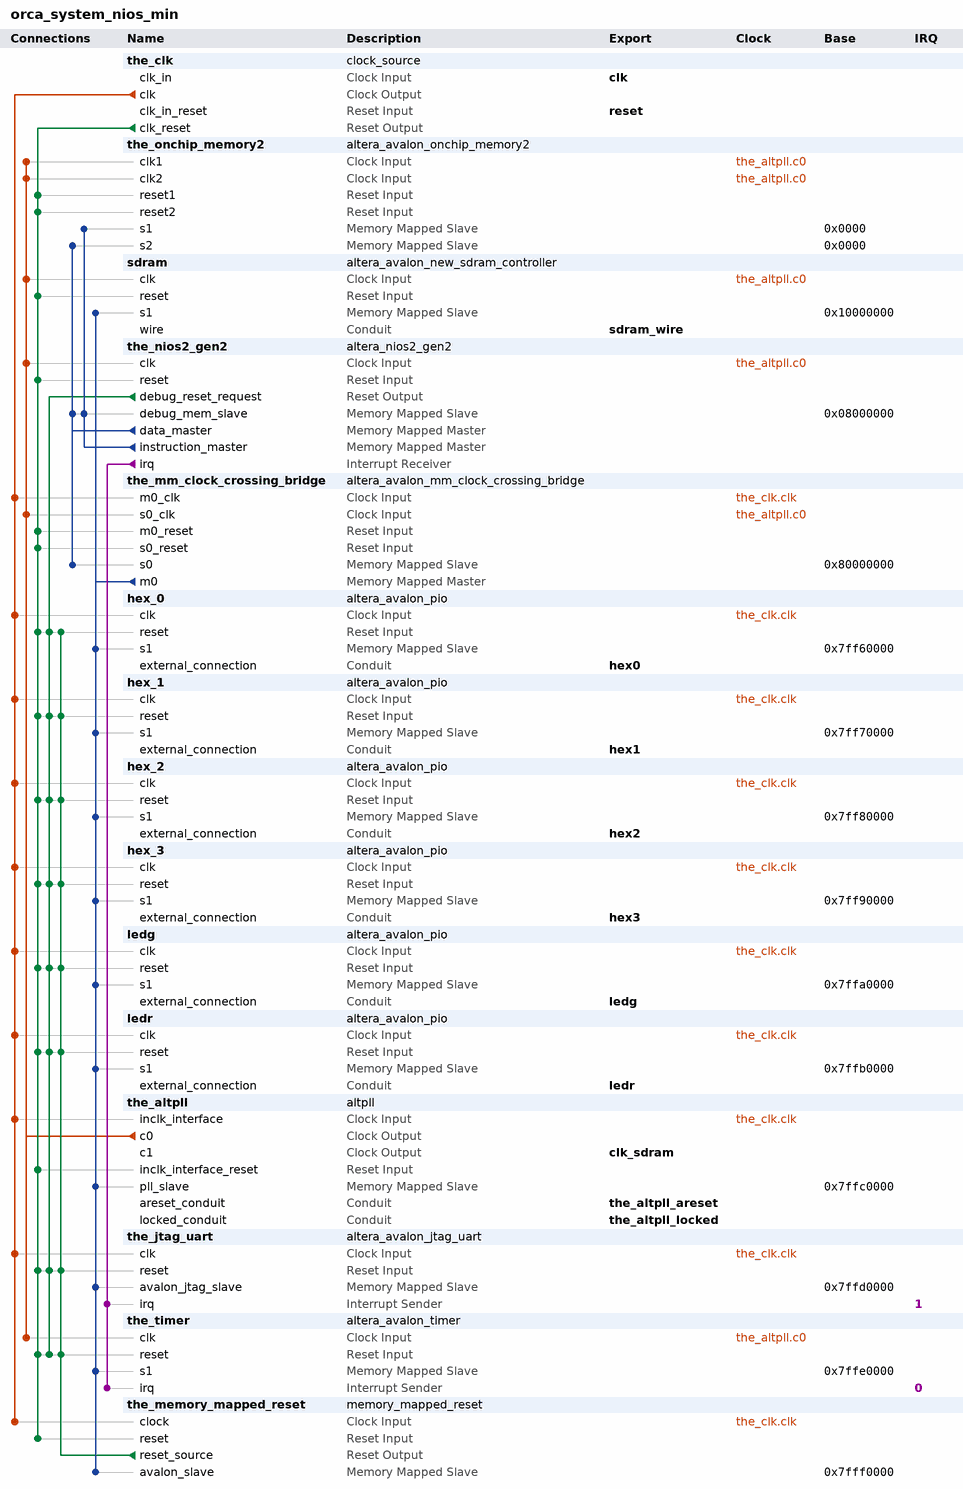
[diagram p0: system contents]
# Platform Designer (Qsys) system orca_system_nios_min, Cyclone IV E EP4CE115F29C7
# Parameters at their usual value, and those the tool derives, are not listed.
package require -exact qsys 17.1
create_system orca_system_nios_min
set_project_property DEVICE_FAMILY {Cyclone IV E}
set_project_property DEVICE EP4CE115F29C7

add_instance the_clk clock_source 17.1
set_instance_parameter_value the_clk clockFrequency 50000000

add_instance the_onchip_memory2 altera_avalon_onchip_memory2 17.1
set_instance_parameter_value the_onchip_memory2 dataWidth 32
set_instance_parameter_value the_onchip_memory2 dualPort true
set_instance_parameter_value the_onchip_memory2 initMemContent true
set_instance_parameter_value the_onchip_memory2 initializationFileName software/test.hex
set_instance_parameter_value the_onchip_memory2 memorySize 65536
set_instance_parameter_value the_onchip_memory2 useNonDefaultInitFile true

add_instance sdram altera_avalon_new_sdram_controller 17.1
set_instance_parameter_value sdram TAC 5.5
set_instance_parameter_value sdram TRCD 20.0
set_instance_parameter_value sdram TRP 20.0
set_instance_parameter_value sdram casLatency 3
set_instance_parameter_value sdram columnWidth 10
set_instance_parameter_value sdram dataWidth 32
set_instance_parameter_value sdram generateSimulationModel true
set_instance_parameter_value sdram model single_Micron_MT48LC4M32B2_7_chip
set_instance_parameter_value sdram numberOfBanks 4
set_instance_parameter_value sdram numberOfChipSelects 1
set_instance_parameter_value sdram powerUpDelay 100.0
set_instance_parameter_value sdram refreshPeriod 15.625
set_instance_parameter_value sdram rowWidth 13

add_instance the_nios2_gen2 altera_nios2_gen2 17.1
set_instance_parameter_value the_nios2_gen2 dcache_size 2048
set_instance_parameter_value the_nios2_gen2 exceptionSlave the_onchip_memory2.s1
set_instance_parameter_value the_nios2_gen2 icache_size 4096
set_instance_parameter_value the_nios2_gen2 impl Tiny
set_instance_parameter_value the_nios2_gen2 resetSlave the_onchip_memory2.s1

add_instance the_mm_clock_crossing_bridge altera_avalon_mm_clock_crossing_bridge 17.1
set_instance_parameter_value the_mm_clock_crossing_bridge ADDRESS_WIDTH 31
set_instance_parameter_value the_mm_clock_crossing_bridge COMMAND_FIFO_DEPTH 4
set_instance_parameter_value the_mm_clock_crossing_bridge DATA_WIDTH 32
set_instance_parameter_value the_mm_clock_crossing_bridge MASTER_SYNC_DEPTH 2
set_instance_parameter_value the_mm_clock_crossing_bridge MAX_BURST_SIZE 1
set_instance_parameter_value the_mm_clock_crossing_bridge RESPONSE_FIFO_DEPTH 4
set_instance_parameter_value the_mm_clock_crossing_bridge SLAVE_SYNC_DEPTH 2
set_instance_parameter_value the_mm_clock_crossing_bridge USE_AUTO_ADDRESS_WIDTH 0

add_instance hex_0 altera_avalon_pio 17.1
set_instance_parameter_value hex_0 direction Output
set_instance_parameter_value hex_0 width 32

add_instance hex_1 altera_avalon_pio 17.1
set_instance_parameter_value hex_1 direction Output
set_instance_parameter_value hex_1 width 32

add_instance hex_2 altera_avalon_pio 17.1
set_instance_parameter_value hex_2 direction Output
set_instance_parameter_value hex_2 width 32

add_instance hex_3 altera_avalon_pio 17.1
set_instance_parameter_value hex_3 direction Output
set_instance_parameter_value hex_3 width 32

add_instance ledg altera_avalon_pio 17.1
set_instance_parameter_value ledg direction Output
set_instance_parameter_value ledg width 32

add_instance ledr altera_avalon_pio 17.1
set_instance_parameter_value ledr direction Output
set_instance_parameter_value ledr width 32

add_instance the_altpll altpll 17.1
set_instance_parameter_value the_altpll CLK0_DIVIDE_BY 1
set_instance_parameter_value the_altpll CLK0_MULTIPLY_BY 2
set_instance_parameter_value the_altpll CLK1_DIVIDE_BY 1
set_instance_parameter_value the_altpll CLK1_DUTY_CYCLE 50
set_instance_parameter_value the_altpll CLK1_MULTIPLY_BY 2
set_instance_parameter_value the_altpll CLK1_PHASE_SHIFT -1500
set_instance_parameter_value the_altpll INCLK0_INPUT_FREQUENCY 20000
set_instance_parameter_value the_altpll PORT_ARESET PORT_USED
set_instance_parameter_value the_altpll PORT_LOCKED PORT_USED
set_instance_parameter_value the_altpll PORT_clk1 PORT_USED
set_instance_parameter_value the_altpll PORT_clk2 PORT_UNUSED
set_instance_parameter_value the_altpll PORT_clk3 PORT_UNUSED

add_instance the_jtag_uart altera_avalon_jtag_uart 17.1
set_instance_parameter_value the_jtag_uart simInteractiveOptions NO_INTERACTIVE_WINDOWS

add_instance the_timer altera_avalon_timer 17.1
set_instance_parameter_value the_timer period 1
set_instance_parameter_value the_timer periodUnits MSEC

add_instance the_memory_mapped_reset memory_mapped_reset 1.0
set_instance_parameter_value the_memory_mapped_reset ADDR_WIDTH 2
set_instance_parameter_value the_memory_mapped_reset REGISTER_SIZE 32

# connections
add_connection the_altpll.c0 sdram.clk clock
add_connection the_altpll.c0 the_mm_clock_crossing_bridge.s0_clk clock
add_connection the_altpll.c0 the_nios2_gen2.clk clock
add_connection the_altpll.c0 the_onchip_memory2.clk1 clock
add_connection the_altpll.c0 the_onchip_memory2.clk2 clock
add_connection the_altpll.c0 the_timer.clk clock
add_connection the_clk.clk hex_0.clk clock
add_connection the_clk.clk hex_1.clk clock
add_connection the_clk.clk hex_2.clk clock
add_connection the_clk.clk hex_3.clk clock
add_connection the_clk.clk ledg.clk clock
add_connection the_clk.clk ledr.clk clock
add_connection the_clk.clk the_altpll.inclk_interface clock
add_connection the_clk.clk the_jtag_uart.clk clock
add_connection the_clk.clk the_memory_mapped_reset.clock clock
add_connection the_clk.clk the_mm_clock_crossing_bridge.m0_clk clock
add_connection the_clk.clk_reset hex_0.reset reset
add_connection the_clk.clk_reset hex_1.reset reset
add_connection the_clk.clk_reset hex_2.reset reset
add_connection the_clk.clk_reset hex_3.reset reset
add_connection the_clk.clk_reset ledg.reset reset
add_connection the_clk.clk_reset ledr.reset reset
add_connection the_clk.clk_reset sdram.reset reset
add_connection the_clk.clk_reset the_altpll.inclk_interface_reset reset
add_connection the_clk.clk_reset the_jtag_uart.reset reset
add_connection the_clk.clk_reset the_memory_mapped_reset.reset reset
add_connection the_clk.clk_reset the_mm_clock_crossing_bridge.m0_reset reset
add_connection the_clk.clk_reset the_mm_clock_crossing_bridge.s0_reset reset
add_connection the_clk.clk_reset the_nios2_gen2.reset reset
add_connection the_clk.clk_reset the_onchip_memory2.reset1 reset
add_connection the_clk.clk_reset the_onchip_memory2.reset2 reset
add_connection the_clk.clk_reset the_timer.reset reset
add_connection the_memory_mapped_reset.reset_source hex_0.reset reset
add_connection the_memory_mapped_reset.reset_source hex_1.reset reset
add_connection the_memory_mapped_reset.reset_source hex_2.reset reset
add_connection the_memory_mapped_reset.reset_source hex_3.reset reset
add_connection the_memory_mapped_reset.reset_source ledg.reset reset
add_connection the_memory_mapped_reset.reset_source ledr.reset reset
add_connection the_memory_mapped_reset.reset_source the_jtag_uart.reset reset
add_connection the_memory_mapped_reset.reset_source the_timer.reset reset
add_connection the_nios2_gen2.debug_reset_request hex_0.reset reset
add_connection the_nios2_gen2.debug_reset_request hex_1.reset reset
add_connection the_nios2_gen2.debug_reset_request hex_2.reset reset
add_connection the_nios2_gen2.debug_reset_request hex_3.reset reset
add_connection the_nios2_gen2.debug_reset_request ledg.reset reset
add_connection the_nios2_gen2.debug_reset_request ledr.reset reset
add_connection the_nios2_gen2.debug_reset_request the_jtag_uart.reset reset
add_connection the_nios2_gen2.debug_reset_request the_timer.reset reset
add_connection the_mm_clock_crossing_bridge.m0 hex_0.s1 avalon
set_connection_parameter_value the_mm_clock_crossing_bridge.m0/hex_0.s1 baseAddress 0x7ff60000
add_connection the_mm_clock_crossing_bridge.m0 hex_1.s1 avalon
set_connection_parameter_value the_mm_clock_crossing_bridge.m0/hex_1.s1 baseAddress 0x7ff70000
add_connection the_mm_clock_crossing_bridge.m0 hex_2.s1 avalon
set_connection_parameter_value the_mm_clock_crossing_bridge.m0/hex_2.s1 baseAddress 0x7ff80000
add_connection the_mm_clock_crossing_bridge.m0 hex_3.s1 avalon
set_connection_parameter_value the_mm_clock_crossing_bridge.m0/hex_3.s1 baseAddress 0x7ff90000
add_connection the_mm_clock_crossing_bridge.m0 ledg.s1 avalon
set_connection_parameter_value the_mm_clock_crossing_bridge.m0/ledg.s1 baseAddress 0x7ffa0000
add_connection the_mm_clock_crossing_bridge.m0 ledr.s1 avalon
set_connection_parameter_value the_mm_clock_crossing_bridge.m0/ledr.s1 baseAddress 0x7ffb0000
add_connection the_mm_clock_crossing_bridge.m0 sdram.s1 avalon
set_connection_parameter_value the_mm_clock_crossing_bridge.m0/sdram.s1 baseAddress 0x10000000
add_connection the_mm_clock_crossing_bridge.m0 the_altpll.pll_slave avalon
set_connection_parameter_value the_mm_clock_crossing_bridge.m0/the_altpll.pll_slave baseAddress 0x7ffc0000
add_connection the_mm_clock_crossing_bridge.m0 the_jtag_uart.avalon_jtag_slave avalon
set_connection_parameter_value the_mm_clock_crossing_bridge.m0/the_jtag_uart.avalon_jtag_slave baseAddress 0x7ffd0000
add_connection the_mm_clock_crossing_bridge.m0 the_memory_mapped_reset.avalon_slave avalon
set_connection_parameter_value the_mm_clock_crossing_bridge.m0/the_memory_mapped_reset.avalon_slave baseAddress 0x7fff0000
add_connection the_mm_clock_crossing_bridge.m0 the_timer.s1 avalon
set_connection_parameter_value the_mm_clock_crossing_bridge.m0/the_timer.s1 baseAddress 0x7ffe0000
add_connection the_nios2_gen2.data_master the_mm_clock_crossing_bridge.s0 avalon
set_connection_parameter_value the_nios2_gen2.data_master/the_mm_clock_crossing_bridge.s0 baseAddress 0x80000000
add_connection the_nios2_gen2.data_master the_nios2_gen2.debug_mem_slave avalon
set_connection_parameter_value the_nios2_gen2.data_master/the_nios2_gen2.debug_mem_slave baseAddress 0x08000000
add_connection the_nios2_gen2.data_master the_onchip_memory2.s2 avalon
set_connection_parameter_value the_nios2_gen2.data_master/the_onchip_memory2.s2 baseAddress 0x0000
add_connection the_nios2_gen2.instruction_master the_nios2_gen2.debug_mem_slave avalon
set_connection_parameter_value the_nios2_gen2.instruction_master/the_nios2_gen2.debug_mem_slave baseAddress 0x08000000
add_connection the_nios2_gen2.instruction_master the_onchip_memory2.s1 avalon
set_connection_parameter_value the_nios2_gen2.instruction_master/the_onchip_memory2.s1 baseAddress 0x0000
add_connection the_nios2_gen2.irq the_jtag_uart.irq interrupt
set_connection_parameter_value the_nios2_gen2.irq/the_jtag_uart.irq irqNumber 1
add_connection the_nios2_gen2.irq the_timer.irq interrupt
set_connection_parameter_value the_nios2_gen2.irq/the_timer.irq irqNumber 0

# exported interfaces
add_interface clk clock sink
set_interface_property clk EXPORT_OF the_clk.clk_in
add_interface clk_sdram clock source
set_interface_property clk_sdram EXPORT_OF the_altpll.c1
add_interface hex0 conduit end
set_interface_property hex0 EXPORT_OF hex_0.external_connection
add_interface hex1 conduit end
set_interface_property hex1 EXPORT_OF hex_1.external_connection
add_interface hex2 conduit end
set_interface_property hex2 EXPORT_OF hex_2.external_connection
add_interface hex3 conduit end
set_interface_property hex3 EXPORT_OF hex_3.external_connection
add_interface ledg conduit end
set_interface_property ledg EXPORT_OF ledg.external_connection
add_interface ledr conduit end
set_interface_property ledr EXPORT_OF ledr.external_connection
add_interface reset reset sink
set_interface_property reset EXPORT_OF the_clk.clk_in_reset
add_interface sdram_wire conduit end
set_interface_property sdram_wire EXPORT_OF sdram.wire
add_interface the_altpll_areset conduit end
set_interface_property the_altpll_areset EXPORT_OF the_altpll.areset_conduit
add_interface the_altpll_locked conduit end
set_interface_property the_altpll_locked EXPORT_OF the_altpll.locked_conduit

set_interconnect_requirement {$system} qsys_mm.clockCrossingAdapter HANDSHAKE
set_interconnect_requirement {$system} qsys_mm.enableEccProtection FALSE
set_interconnect_requirement {$system} qsys_mm.insertDefaultSlave FALSE
set_interconnect_requirement {$system} qsys_mm.maxAdditionalLatency 1

save_system orca_system_nios_min.qsys
